# EAGLE schematic schematic (EAGLE 9.2.0)
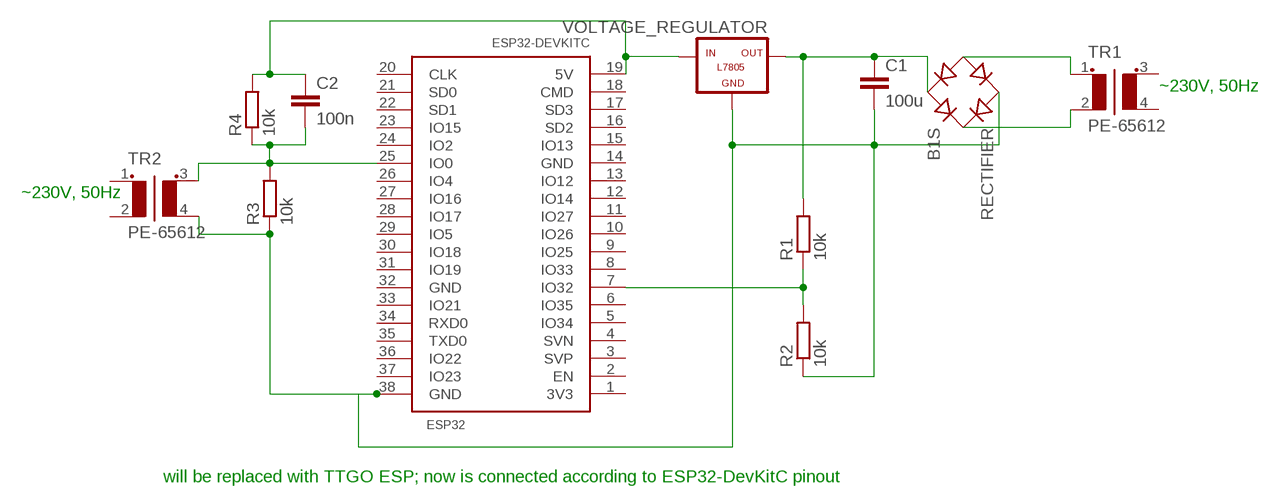
[diagram p0: schematic, sheet 1]

## Parts
C1  100u  C2,5-3  [C2.5-3]
C2  100n  C2,5-3  [C2.5-3]
ESP32  ESP32DEVKITC  [ESP32-DEVKITC]
R1  10k  R-EU_0204/2V  [0204V]
R2  10k  R-EU_0204/2V  [0204V]
R3  10k  R-EU_0204/2V  [0204V]
R4  10k  R-EU_0204/2V  [0204V]
RECTIFIER  B1S  [MBS]
TR1  PE-65612  [PE-65612]
TR2  PE-65612  [PE-65612]
VOLTAGE_REGULATOR  -L7805  [L7805]

## Nets
N$1: C2.1 ESP32.19(5V) R4.2 VOLTAGE_REGULATOR.IN
N$2: C2.2 ESP32.25(IO0) R3.2 R4.1 TR2.3(S1)
N$3: C1.1 R1.2 RECTIFIER.AC2 VOLTAGE_REGULATOR.OUT
N$4: ESP32.7(IO32) R1.1 R2.2
N$5: RECTIFIER.- TR1.1
N$6: C1.2 ESP32.38(GND) R2.1 R3.1 RECTIFIER.AC1 TR2.4(S2) VOLTAGE_REGULATOR.GND
N$7: RECTIFIER.+ TR1.2
Unconnected: ESP32.1(3V3) ESP32.2(EN) ESP32.3(SVP) ESP32.4(SVN) ESP32.5(IO34) ESP32.6(IO35) ESP32.8(IO33) ESP32.9(IO25) ESP32.10(IO26) ESP32.11(IO27) ESP32.12(IO14) ESP32.13(IO12) ESP32.14(GND) ESP32.15(IO13) ESP32.16(SD2) ESP32.17(SD3) ESP32.18(CMD) ESP32.20(CLK) ESP32.21(SD0) ESP32.22(SD1) ESP32.23(IO15) ESP32.24(IO2) ESP32.26(IO4) ESP32.27(IO16) ESP32.28(IO17) ESP32.29(IO5) ESP32.30(IO18) ESP32.31(IO19) ESP32.32(GND) ESP32.33(IO21) ESP32.34(RXD0) ESP32.35(TXD0) ESP32.36(IO22) ESP32.37(IO23) TR1.3(S1) TR1.4(S2) TR2.1 TR2.2

## Notes on the sheet
- ~230V, 50Hz
- ~230V, 50Hz
- will be replaced with TTGO ESP; now is connected according to ESP32-DevKitC pinout

## Library data of the parts
C1 C2 = capacitor-wima:C: CAPACITOR naming: grid - package width
ESP32 = ESP32-DEVKITC:ESP32DEVKITC
R1-R4 = resistor:R-EU_: RESISTOR, European symbol
RECTIFIER = rectifier:B*S: Surface Mount Glass Passivated Bridge Rectifiers Source: Comchip Bridge Rectifiers B05S-G_B10S-G.pdf
TR1 TR2 = transformer-pulse:PE-65612: TRANSFORMERS FOR DIGITAL AUDIO DATA TRANSMISSION Source: Data sheet <http://ww2.pulseeng.com/products/datasheets/T601.pdf> www.pulseeng.com
VOLTAGE_REGULATOR = tango:-L7805